# EAGLE schematic Kopplingsschema (EAGLE 8.6.0)
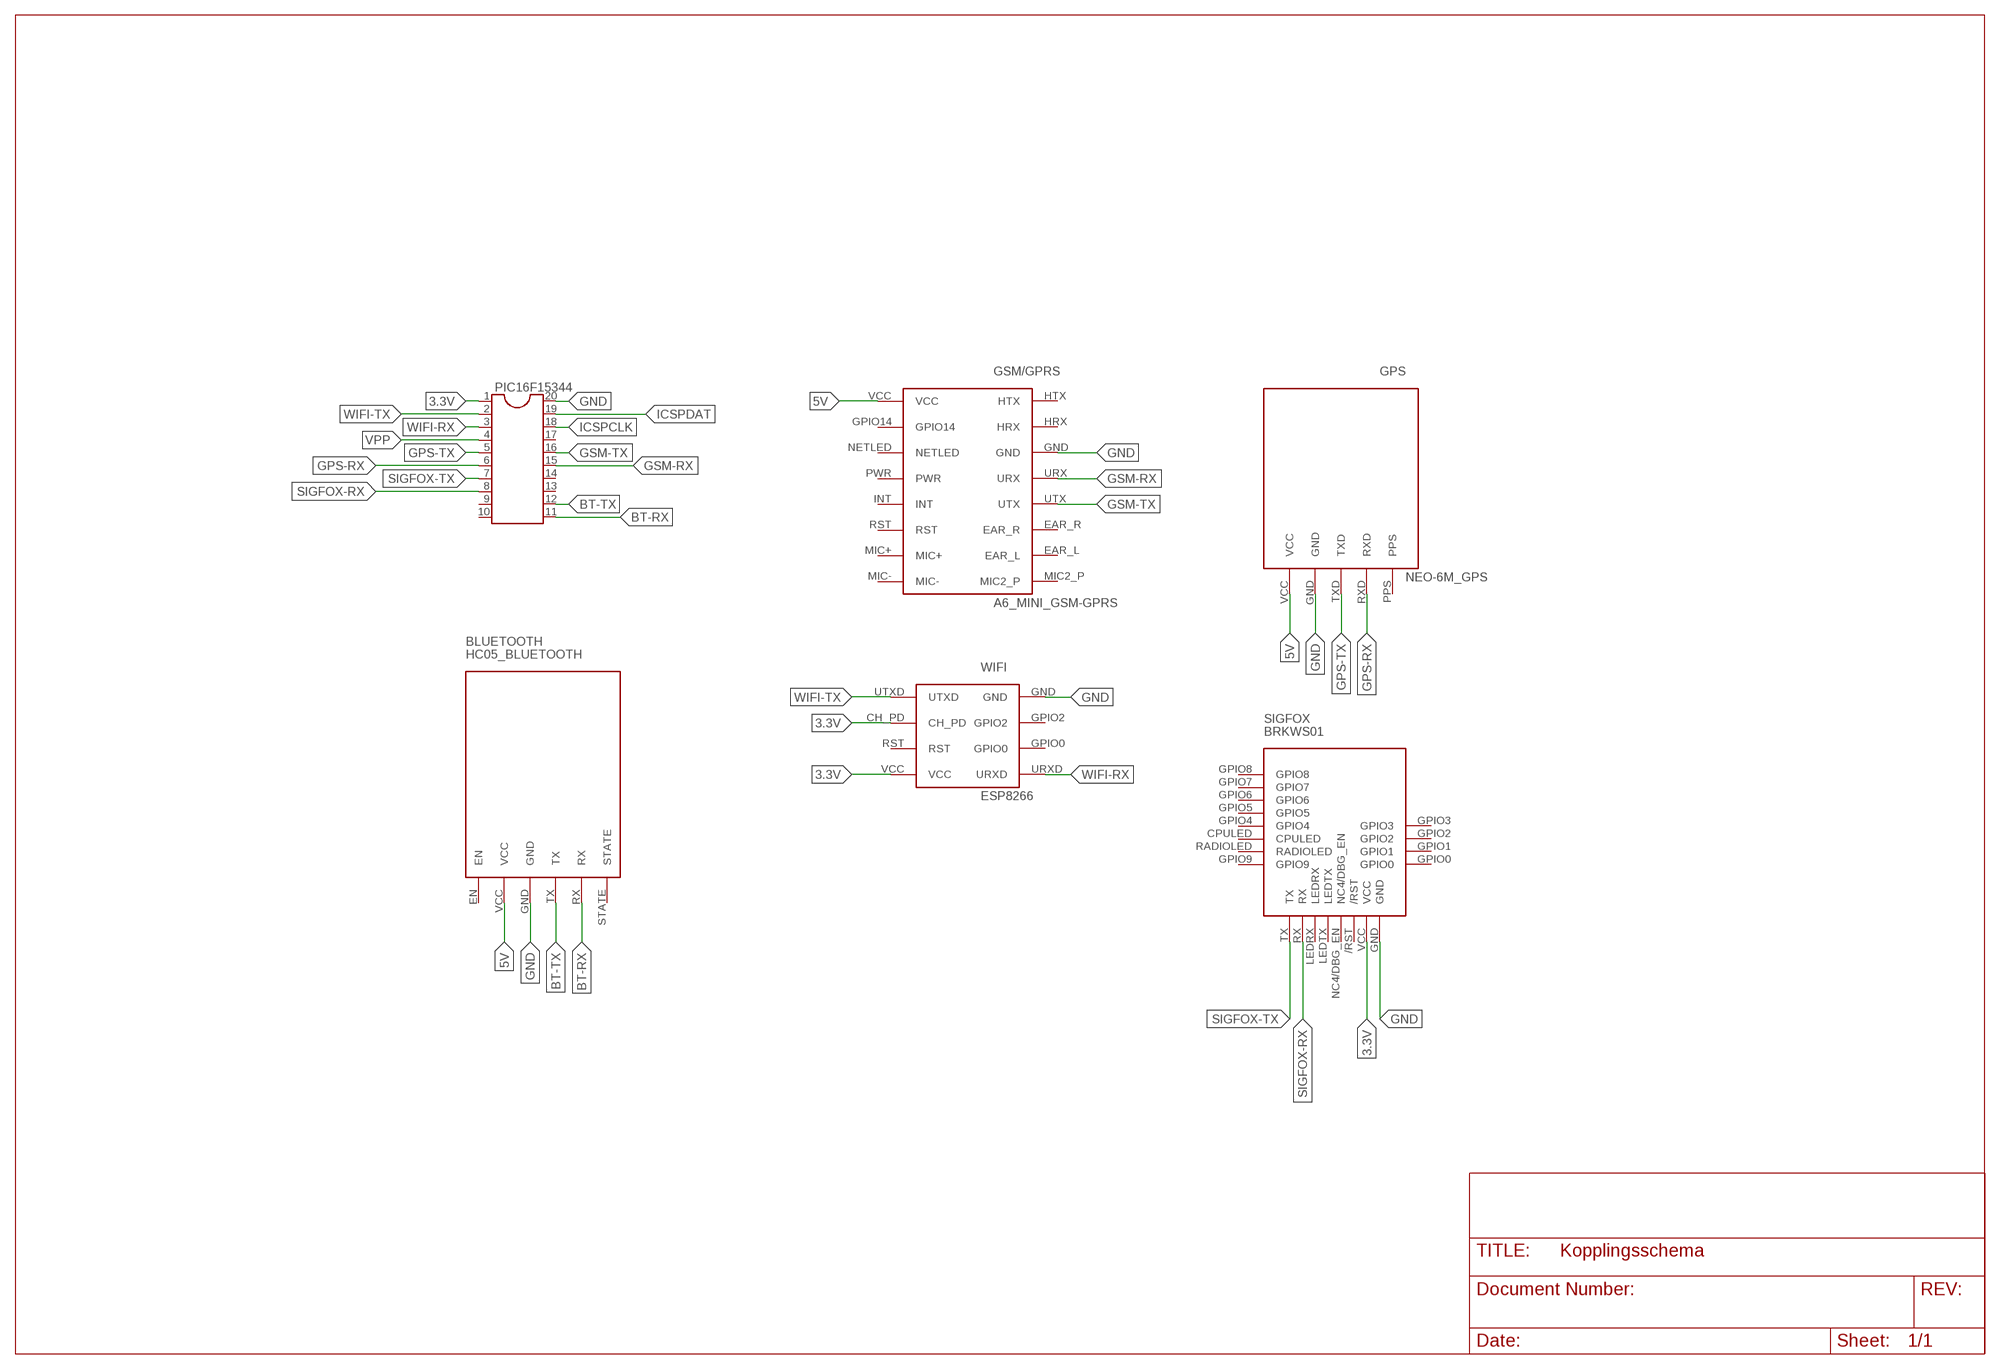
[diagram p0: schematic, sheet 1]

## Parts
BLUETOOTH  HC05_BLUETOOTH  [HC05_BLUETOOTH]
GPS  NEO-6M_GPS  [NEO-6M_GPS]
GSM/GPRS  A6_MINI_GSM-GPRS  [A6_MINI_GSM-GPRS]
PIC16F15344  DIL20  [DIL20]
SIGFOX  BRKWS01  [BRKWS01]
WIFI  ESP8266  [ESP8266]

## Nets
3.3V: PIC16F15344.1 SIGFOX.VCC WIFI.CH_PD WIFI.VCC
5V: BLUETOOTH.VCC GPS.VCC GSM/GPRS.VCC
BT-RX: BLUETOOTH.RX PIC16F15344.11
BT-TX: BLUETOOTH.TX PIC16F15344.12
GND: BLUETOOTH.GND GPS.GND GSM/GPRS.GND PIC16F15344.20 SIGFOX.GND WIFI.GND
GPS-RX: GPS.RXD PIC16F15344.6
GPS-TX: GPS.TXD PIC16F15344.5
GSM-RX: GSM/GPRS.URX PIC16F15344.15
GSM-TX: GSM/GPRS.UTX PIC16F15344.16
ICSPCLK: PIC16F15344.18
ICSPDAT: PIC16F15344.19
SIGFOX-RX: PIC16F15344.8 SIGFOX.RX
SIGFOX-TX: PIC16F15344.7 SIGFOX.TX
VPP: PIC16F15344.4
WIFI-RX: PIC16F15344.3 WIFI.URXD
WIFI-TX: PIC16F15344.2 WIFI.UTXD
Unconnected: BLUETOOTH.EN BLUETOOTH.STATE GPS.PPS GSM/GPRS.EAR_L GSM/GPRS.EAR_R GSM/GPRS.GPIO14 GSM/GPRS.HRX GSM/GPRS.HTX GSM/GPRS.INT GSM/GPRS.MIC2_P GSM/GPRS.MIC+ GSM/GPRS.MIC- GSM/GPRS.NETLED GSM/GPRS.PWR GSM/GPRS.RST PIC16F15344.9 PIC16F15344.10 PIC16F15344.13 PIC16F15344.14 PIC16F15344.17 SIGFOX./RST SIGFOX.CPULED SIGFOX.GPIO0 SIGFOX.GPIO1 SIGFOX.GPIO2 SIGFOX.GPIO3 SIGFOX.GPIO4 SIGFOX.GPIO5 SIGFOX.GPIO6 SIGFOX.GPIO7 SIGFOX.GPIO8 SIGFOX.GPIO9 SIGFOX.LEDRX SIGFOX.LEDTX SIGFOX.NC4/DBG_EN SIGFOX.RADIOLED WIFI.GPIO0 WIFI.GPIO2 WIFI.RST

## Library data of the parts
BLUETOOTH = jens:HC05_BLUETOOTH
GPS = jens:NEO-6M_GPS
GSM/GPRS = jens:A6_MINI_GSM-GPRS
PIC16F15344 = ic-package:DIL20: Dual In Line / Socket
SIGFOX = jens:BRKWS01
WIFI = jens:ESP8266